# EAGLE design Thermal DB Fan (EAGLE 5.06)
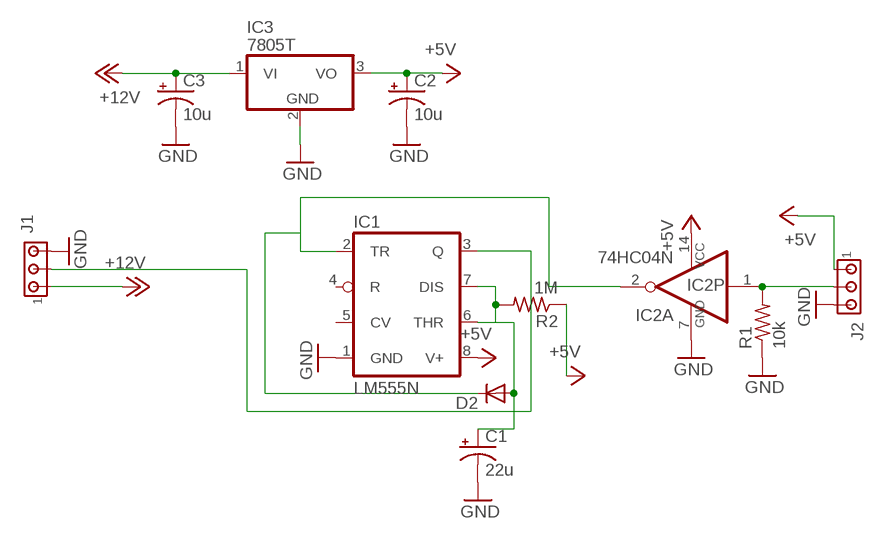
[diagram p0: schematic, sheet 1]

## Parts
C1  22u  CPOL-USE2.5-6  [E2,5-6]
C2  10u  CPOL-USE2.5-6  [E2,5-6]
C3  10u  CPOL-USE2.5-6  [E2,5-6]
D2  DIODE-D-7.5  [D-7.5]
IC1  LM555N  [DIL08]
IC2  74HC04N  [DIL14]
IC3  7805T  [TO220H]
J1  MTA03-156  [1X3MTA]
J2  MTA03-100  [10X03MTA]
R1  10k  R-US_0204/7  [0204/7]
R2  1M  R-US_0204/7  [0204/7]

## Nets
+5V: C2.+ IC1.8(V+) IC2.14(P:VCC) IC3.3(VO) J2.1 R2.1
+12V: C3.+ IC3.1(VI) J1.1
GND: C1.- C2.- C3.- IC1.1(GND) IC2.7(P:GND) IC3.2(GND) J1.3 J2.3 R1.1
N$1: IC2.1(A:I) J2.2 R1.2
N$2: C1.+ D2.A IC1.6(THR) IC1.7(DIS) R2.2
N$3: D2.C IC1.2(TR) IC2.2(A:O)
N$4: IC1.3(Q) J1.2
Unconnected: IC1.4(R) IC1.5(CV) IC2.3(B:I) IC2.4(B:O) IC2.5(C:I) IC2.6(C:O) IC2.8(D:O) IC2.9(D:I) IC2.10(E:O) IC2.11(E:I) IC2.12(F:O) IC2.13(F:I)

## Library data of the parts
C1-C3 = rcl:CPOL-US: POLARIZED CAPACITOR, American symbol
D2 = diode:DIODE-: DIODE
IC1 = linear:*555: TIMER
IC2 = 74xx-eu:74*04: Hex INVERTER
IC3 = linear:78*: Positive VOLTAGE REGULATOR Source: http://cache.national.com/ds/LM/LM78L05.pdf http://www.fairchildsemi.com/ds/LM/LM7805.pdf
J1 = con-amp:MTA03-156: AMP connector
J2 = con-amp:MTA03-100: AMP connector
R1 R2 = rcl:R-US_: RESISTOR, American symbol

## Board
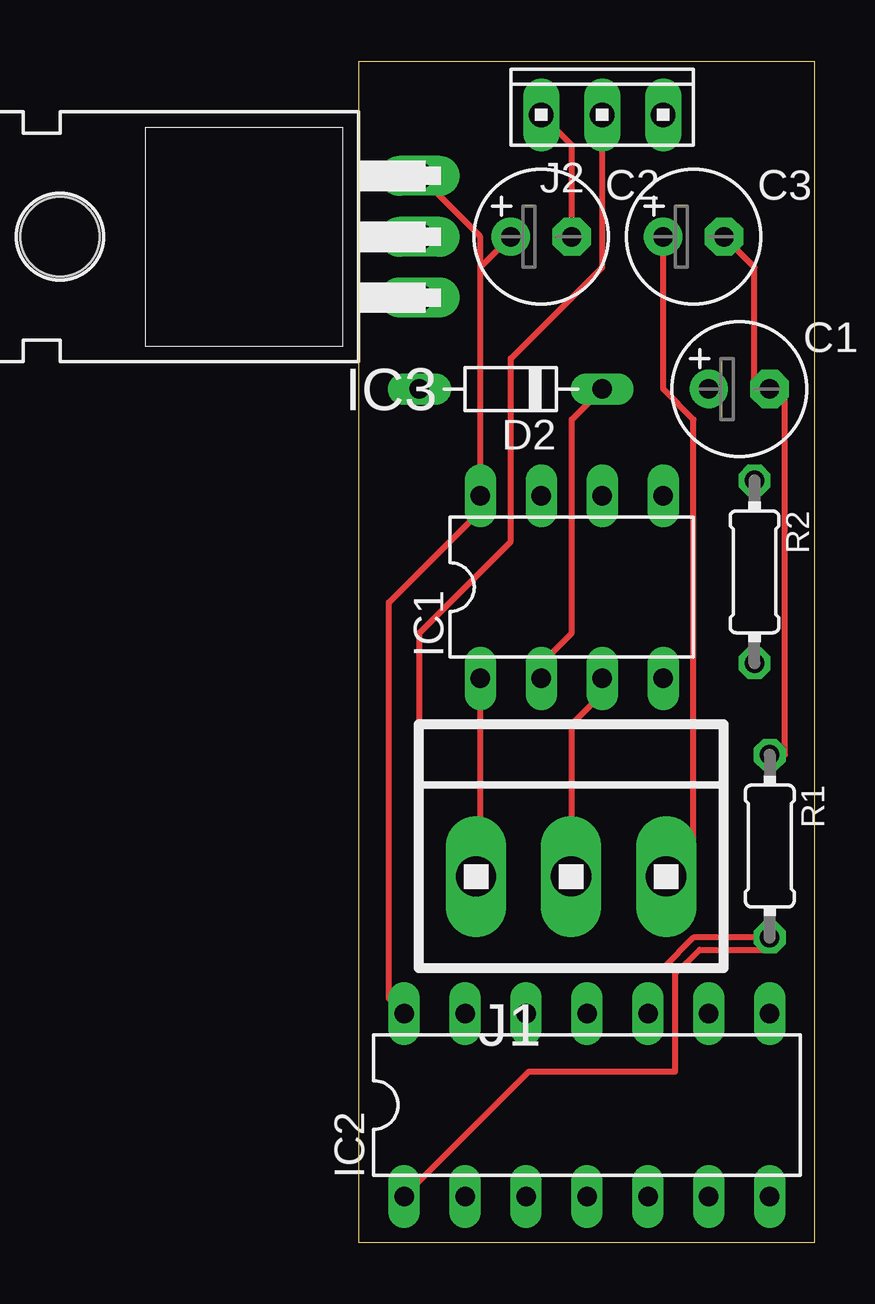
[diagram p1: board, top side]
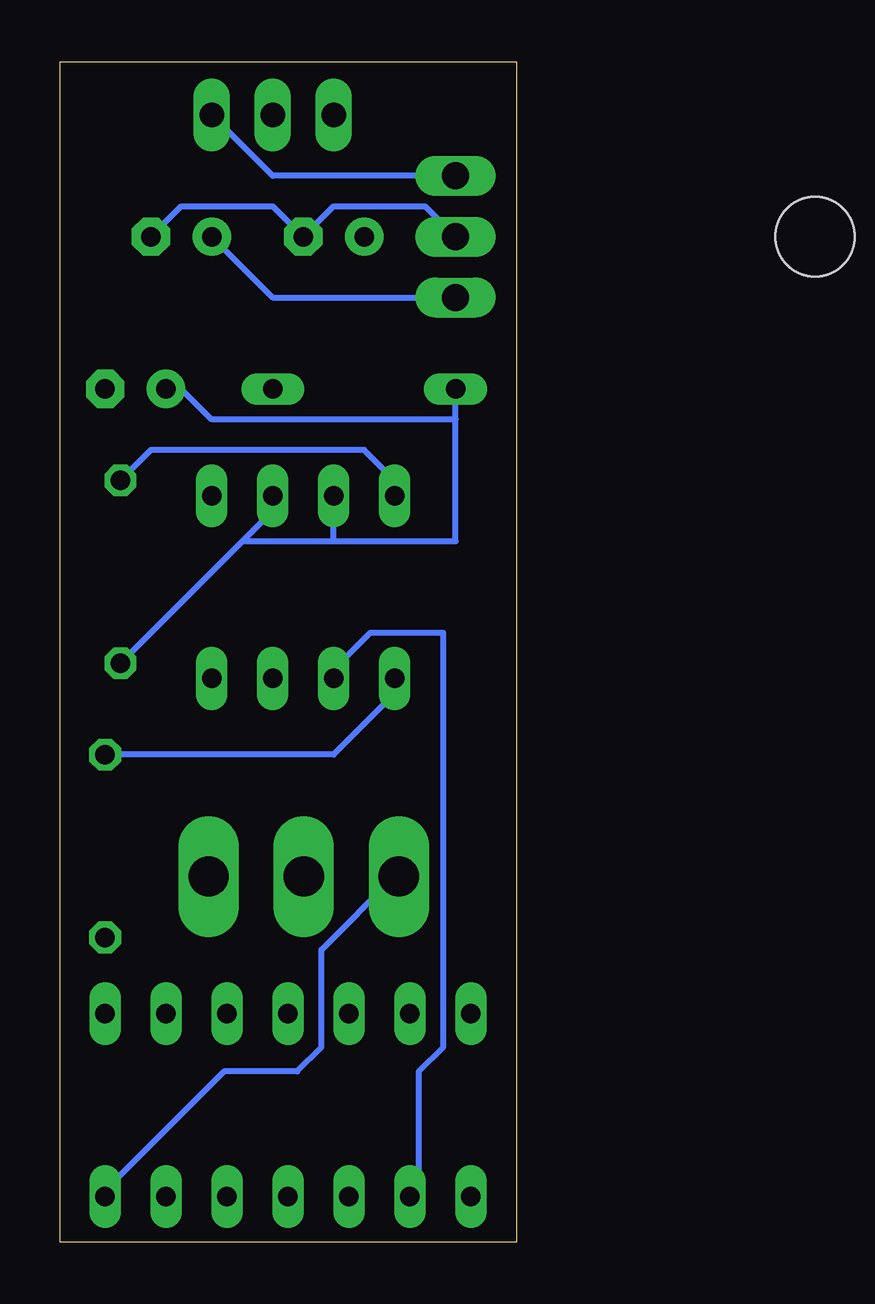
[diagram p2: board, bottom side, seen from below]

Size 19.03 x 49.2 mm. Coordinates in mm from the lower left corner, seen from the top.
Outline: 0,0 19.03,0 19.03,49.2 0,49.2 0,0
Copper layers (1*16): Top 0.035mm / dielectric 1.5mm / Bottom 0.035mm
Design rules "default": minimum track width 10mil, minimum drill 24mil, track to track 8mil, track to pad 8mil, pad to pad 8mil, via to via 8mil, smd to smd 8mil, copper to edge 40mil, drill to drill 8mil, minimum pad ring 10mil, minimum via ring 8mil, stop-mask expansion 4mil, vias tented up to drill 0mil, thermal gap 10mil

### Footprints (pad centres in the part's own frame; a part is rotated, then mirrored left to right if it is on the bottom)
E2,5-6 = drill 0.813 pad 1.6 round: + -1.27,0 | drill 0.813 pad 1.6 octagon: - 1.27,0
D-7.5 = drill 0.813 long: A 3.81,0; C -3.81,0
DIL08 = drill 0.813 long: 1 -3.81,-3.81; 2 -1.27,-3.81; 3 1.27,-3.81; 4 3.81,-3.81; 5 3.81,3.81; 6 1.27,3.81; 7 -1.27,3.81; 8 -3.81,3.81
DIL14 = drill 0.813 long: 1 -7.62,-3.81; 2 -5.08,-3.81; 3 -2.54,-3.81; 4 0,-3.81; 5 2.54,-3.81; 6 5.08,-3.81; 7 7.62,-3.81; 8 7.62,3.81; 9 5.08,3.81; 10 2.54,3.81; 11 0,3.81; 12 -2.54,3.81; 13 -5.08,3.81; 14 -7.62,3.81
TO220H = drill 1.118 long: 1 -2.54,-10.16; 2 0,-10.16; 3 2.54,-10.16 | hole 3.302: 0,4.826
1X3MTA = drill 1.676 long: 1 3.937,0; 2 -0.025,0; 3 -3.988,0
10X03MTA = drill 1.016 long: 1 2.54,0; 2 0,0; 3 -2.54,0
0204/7 = drill 0.813 octagon: 1 -3.81,0; 2 3.81,0

### Placement (x,y rotation side)
C1  15.88,35.56 0 top
C2  7.62,41.91 0 top
C3  13.97,41.91 0 top
D2  6.35,35.56 180 top
IC1  8.89,27.3 0 top
IC2  9.53,5.71 0 top
IC3  -7.62,41.91 90 top
J1  8.89,15.24 0 top
J2  10.16,46.99 0 top
R1  17.14,16.51 270 top
R2  16.51,27.94 270 top

### Tracks (layer width: path | path; a pad name or v marks a point on that pad's centre or on a via)
+5V
  Top 0.254: IC2.14 1.27,10.16 1.27,26.67 5.08,30.48 IC1.8 5.08,40.64 | 5.08,40.64 C2.+ | IC3.3 5.08,41.91 5.08,40.64
  Bottom 0.254: J2.1 10.16,44.45 IC3.3 | R2.1 15.24,33.02 6.35,33.02 5.08,31.75 IC1.8
+12V
  Top 0.254: C3.+ 12.7,35.56 13.97,34.29 13.97,15.24 J1.1
  Bottom 0.254: C3.+ 10.16,39.37 IC3.1
GND
  Top 0.254: IC1.1 5.08,15.24 J1.3 | J2.3 8.89,45.72 C2.- | R1.1 17.78,20.32 17.78,35.56 C1.- 16.51,35.56 16.51,40.64 C3.-
  Bottom 0.254: IC3.2 3.81,43.18 7.62,43.18 C2.- 10.16,43.18 13.97,43.18 C3.- | IC1.1 5.08,22.86 7.62,20.32 R1.1 | IC2.7 17.27,2.03 12.19,7.11 9.14,7.11 8.13,8.13 8.13,12.19 5.08,15.24 J1.3
N$1
  Top 0.254: J2.2 10.16,40.64 6.35,36.83 6.35,29.21 2.54,25.4 2.54,11.43 12.7,11.43 13.97,12.7 R1.2 17.27,12.19 14.22,12.19 13.21,11.18 13.21,7.11 7.11,7.11 IC2.1
N$2
  Bottom 0.254: 11.43,29.21 10.16,30.48 IC1.6 | 11.43,29.21 R2.2 | 2.54,34.29 2.54,29.21 7.62,29.21 | 2.54,34.29 D2.A | 7.62,29.21 11.43,29.21 | 7.62,29.21 IC1.7 | 2.54,34.29 12.7,34.29 13.97,35.56 C1.+
N$3
  Top 0.254: D2.C 8.89,34.29 8.89,25.4 7.62,24.13 IC1.2
  Bottom 0.254: IC2.2 4.06,2.03 4.06,7.11 3.05,8.13 3.05,25.4 6.1,25.4 7.11,24.38 IC1.2
N$4
  Top 0.254: IC1.3 10.16,22.86 8.89,21.59 8.89,15.24 J1.2